# Altium project Lion tracker.PrjPCB (part 4 of 4)
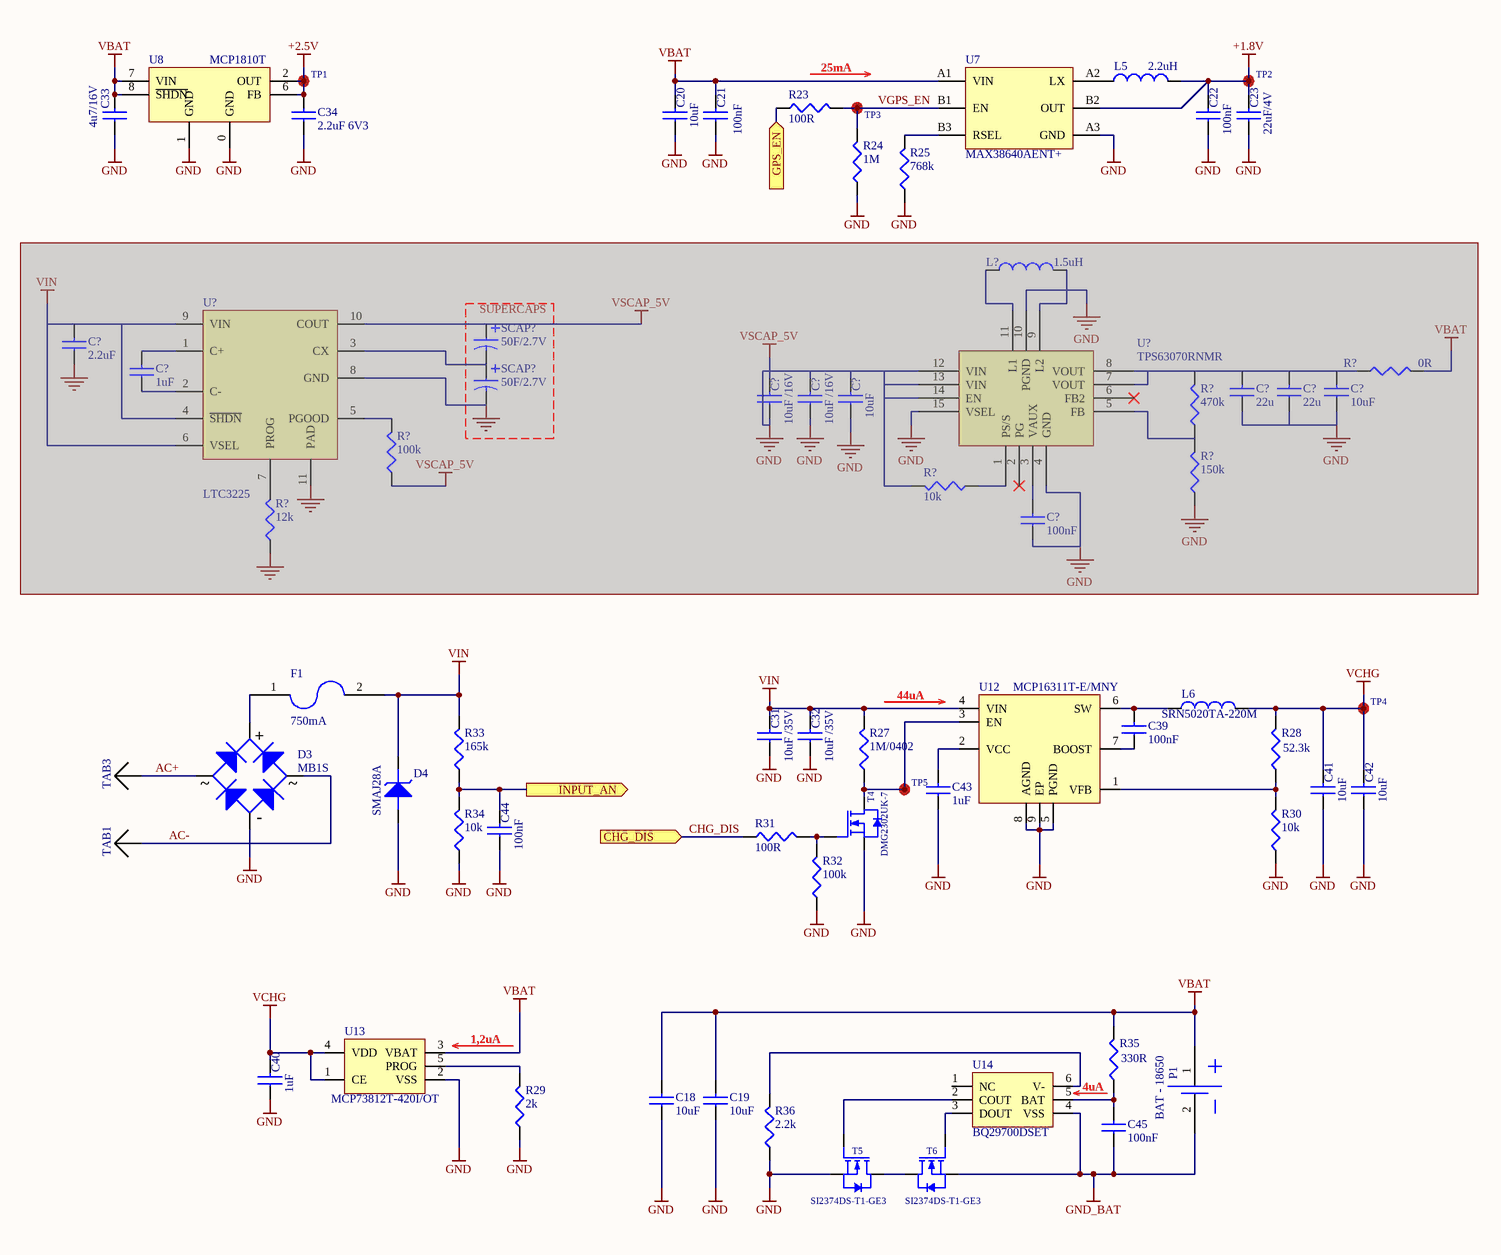
[diagram p6: POWER.SchDoc]

## Sheet POWER.SchDoc (continued)

### Library data of the parts (continued)
U12 = V_SW - MCP16311T-E/MNY: DC-DC Synchronous Buck Regulator, Adjustable, 4.4V to 30V In, 2V to 24V/1A Out, 500kHz; Manufacturer: ROHM; Manufacturer Part Number: BD70522GUL; Topology: Buck (Step Down); Input Voltage Min: 4.5; Input Voltage Max: 45; No. of Outputs: 1; DC / DC Converter IC Case: TO-263; No. of Pins: 5; Output Current: 3; Output Voltage Min: 1.23; Output Voltage Max: 37; Switching Frequency: 150; SVHC: No SVHC (12-Jan-2017; RoHS: YES; Operating Temperature Max: 125; Packaging: Each; Product Range: -; Automotive Qualification Standard: -; MSL: MSL 1 - Unlimited; ComponentLink1Description: DataSheet; ComponentLink1URL: http://www.farnell.com/datasheets/1886710.pdf?_ga=2.254397512.1501170171.1569221802-1373726713.1554121096&_gac=1.218101220.1567774175.Cj0KCQjwh8jrBRDQARIsAH7BsXewc7Dwr4vpljjl78IYTw8YgbCKKX8PqbiwpEZSRALCWSJq0A6KVZoaAvm4EALw_wcB; Supplier 1: Farnell; Supplier Part Number 1: 2857600
U13 = V_CHG - MCP73812T-420I/OT: Battery Charger for 1 Cell of Li-Ion, Li-Pol battery, 6V input, 4.2V / 500mA charge; Manufacturer: ROHM; Manufacturer Part Number: BD70522GUL; Topology: Buck (Step Down); Input Voltage Min: 4.5; Input Voltage Max: 45; No. of Outputs: 1; DC / DC Converter IC Case: TO-263; No. of Pins: 5; Output Current: 3; Output Voltage Min: 1.23; Output Voltage Max: 37; Switching Frequency: 150; SVHC: No SVHC (12-Jan-2017; RoHS: YES; Operating Temperature Max: 125; Packaging: Each; Product Range: -; Automotive Qualification Standard: -; MSL: MSL 1 - Unlimited; ComponentLink1Description: DataSheet; ComponentLink1URL: http://www.farnell.com/datasheets/77596.pdf?_ga=2.208849234.1501170171.1569221802-1373726713.1554121096&_gac=1.183481812.1567774175.Cj0KCQjwh8jrBRDQARIsAH7BsXewc7Dwr4vpljjl78IYTw8YgbCKKX8PqbiwpEZSRALCWSJq0A6KVZoaAvm4EALw_wcB; Supplier 1: Farnell; Supplier Part Number 1: 1627187
U14 = BAT_PROTECT - BQ29700DSET: Li-Ion Battery, Li-Pol Voltage & Current Protector, Single Cell, 1.5 V to 8 V supply,; Manufacturer: ON SEMICONDUCTOR; Manufacturer Part Number: LM2596DSADJG; Topology: Buck (Step Down); Input Voltage Min: 4.5; Input Voltage Max: 45; No. of Outputs: 1; DC / DC Converter IC Case: TO-263; No. of Pins: 5; Output Current: 3; Output Voltage Min: 1.23; Output Voltage Max: 37; Switching Frequency: 150; SVHC: No SVHC (12-Jan-2017; RoHS: YES; Stock 1: 342; Pricing 1: 1=1.98, 10=1.49, 100=1.19, 500=1.04, 1000=0.859, 2500=0.785 (GBP); Operating Temperature Max: 125; Packaging: Each; Product Range: -; Automotive Qualification Standard: -; MSL: MSL 1 - Unlimited; ComponentLink1Description: Datasheet; ComponentLink1URL: http://www.ti.com/lit/ds/symlink/bq2970.pdf; Supplier 1: Farnell; Supplier Part Number 1: 3123826
U?#1 = LTC3225EDDB#TRMPBF: LINEAR TECHNOLOGY         LTC3225EDDB#TRMPBF            IC, SUPERCAP CHARGER, 150MA, 10DFN; Manufacturer: Analog Devices / Linear Technology; Number of Cells: 2; Max Input Voltage: 5.5V; Min Supply Voltage: 2.8V; Operating Supply Current: 20uA; Max Output Voltage: 5.3V; Max Charge Current: 175mA; Topology: Charge Pump; Supplier 1: Digi-Key; Manufacturer Part Number: LTC3225EDDB#TRMPBF; Stock 1: 500; Pricing 1: 500=2.397 (USD); Case/Package: DFN EP; Number of Pins: 10; Min Operating Temperature: -40°C; Max Operating Temperature: 85°C; Max Supply Voltage: 5.5V; Package Quantity: 1; Packaging: Tape and Reel; Termination: SMD/SMT; Length: 3mm; Radiation Hardening: No; REACH SVHC: No SVHC; Lead Free: Lead Free; ComponentLink1URL: https://datasheet.ciiva.com/1144/370169-1144965.pdf; ComponentLink1Description: https://datasheet.ciiva.com/1144/370169-1144965.pdf; ComponentLink2URL: https://datasheet.ciiva.com/26883/ltc3225eddb-trmpbf-26883289.pdf; ComponentLink2Description: https://datasheet.ciiva.com/26883/ltc3225eddb-trmpbf-26883289.pdf; ComponentLink3URL: https://datasheet.ciiva.com/22693/1705664-22693414.pdf; ComponentLink3Description: https://datasheet.ciiva.com/22693/1705664-22693414.pdf; ComponentLink4URL: https://datasheet.ciiva.com/1964/26420-1964792.pdf; ComponentLink4Description: https://datasheet.ciiva.com/1964/26420-1964792.pdf; ComponentLink5URL: https://datasheet.ciiva.com/1964/26420-1964793.pdf; ComponentLink5Description: https://datasheet.ciiva.com/1964/26420-1964793.pdf; ComponentLink6URL: https://datasheet.ciiva.com/1964/26420-1964794.pdf; ComponentLink6Description: https://datasheet.ciiva.com/1964/26420-1964794.pdf; ComponentLink7URL: https://datasheet.ciiva.com/15104/getdatasheetpartid-372123-15104298.pdf; ComponentLink7Description: https://datasheet.ciiva.com/15104/getdatasheetpartid-372123-15104298.pdf; ComponentLink8URL: https://datasheet.ciiva.com/1139/1441932-1139820.pdf; ComponentLink8Description: https://datasheet.ciiva.com/1139/1441932-1139820.pdf; ComponentLink9URL: https://datasheet.ciiva.com/1139/1441932-1139821.pdf; ComponentLink9Description: https://datasheet.ciiva.com/1139/1441932-1139821.pdf; Supplier Part Number 1: LTC3225EDDB#TRMPBFTR-ND
U?#2 = TPS63070RNMR: Buck-Boost Switching Regulator IC Positive Adjustable 2.5V 1 Output 2A 15-PowerVFQFN; Manufacturer: Texas Instruments; Number of Outputs: 1; Min Input Voltage: 2V; Max Input Voltage: 16V; Max Output Voltage: 9V; Switching Frequency: 2.4MHz; Synchronous Rectifier: Yes; Quiescent Current: 50uA; Supplier 1: Digi-Key; Manufacturer Part Number: TPS63070RNMR; Stock 1: 27521; Pricing 1: 1=2.67, 10=2.402, 100=1.9306, 500=1.5862, 1000=1.31428 (USD); Mount: Surface Mount; Case/Package: VQFN; Number of Pins: 15; Min Operating Temperature: -40°C; Max Operating Temperature: 125°C; Packaging: Tape and Reel; Min Output Voltage: 2.5V; Output Current: 2A; Topology: Buck-Boost; Output Type: Adjustable; Output Configuration: Positive; Lead Free: Lead Free; Supplier Part Number 1: 296-44874-1-ND; ComponentLink1Description: Datasheet; ComponentLink1URL: http://www.ti.com/lit/ds/symlink/tps63070.pdf

## Nets that join several sheets
+1.8V: GPS (12 pins), POWER (5 pins)
+2.5V: MAIN (R10.2 R11.2), SENSORS (6 pins), MCU (9 pins), GPS (R6.2 R8.2), POWER (C34.2 TP1.0 U8.2 U8.6)
GND: MAIN (17 pins), SENSORS (8 pins), MCU (29 pins), GPS (24 pins), POWER (33 pins)
VBAT: MAIN (CON1.1 R13.2 T2.4), MCU (R20.2 T3.4), POWER (11 pins)
A_INT1: SENSORS (U10.12), MCU (U4.37)
A_INT2: SENSORS (U10.11), MCU (U4.38)
BAT_AN: MAIN (C10.2 R12.1 R15.2), MCU (U4.22)
BAT_MON_EN: MAIN (R14.1), MCU (U4.45)
CHG_DIS: MCU (U4.2), POWER (R31.1)
GPS_EN: MCU (U4.39), POWER (R23.1)
GPS_RX: MCU (U4.18), GPS (R8.1 T1.3)
GPS_TX: MCU (U4.19), GPS (R6.1 T1.6)
INPUT_AN: MCU (U4.21), POWER (C44.2 R33.1 R34.2)
LED: MAIN (R9.1), MCU (U4.33)
LORA_ANT: MAIN (L4.2 L7.1), MCU (U5.1)
REED: SENSORS (U9.2), MCU (U4.46)
RESET: MAIN (CON1.3), MCU (C11.2 R18.1 U4.34)
SCL: MAIN (R10.1), SENSORS (U10.1), MCU (U4.35)
SCLK: MAIN (U3.3), MCU (U4.16)
SDA: MAIN (R11.1), SENSORS (U10.4), MCU (U4.36)
SDAT: MAIN (U3.12), MCU (U4.14)
SEN: MAIN (U3.1), MCU (U4.17)
SWCLK: MAIN (CON1.4), MCU (U4.42)
SWDIO: MAIN (CON1.2), MCU (U4.41)
TCXO_VCC: MAIN (C8.2 C9.2 U3.4), MCU (U4.1 U4.48)
UART2_TX: MAIN (CON1.6), MCU (U4.24)
VBKP: MCU (C17.2 U4.20), GPS (R2.1)

## Assembly variants
BASIC: not fitted CON1 TAB1 TAB3
BOM: not fitted CON1 P1 TP1 TP2 TP3 TP4 TP5
Wisent: not fitted C29 C30 C31 C32 C39 C40 C41 C42 C43 C44 C45 D3 D4 F1 L4 L6 R27 R28 R29 R30 R31 R32 R33 R35 R36 T4 T5 T6 TAB1 TAB3 U12 U13 U14